# Altium schematic sheet rs485.SchDoc
size A4; Engineer: Amir Hossein Jobeiri; Organization: Simaran; SheetNumber: 23; SheetTotal: 24
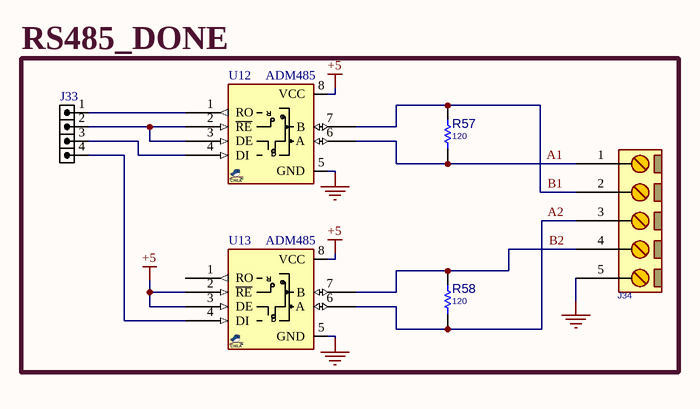
[diagram p0: rs485.SchDoc]

## Parts
J33  HDR1X4  [HDR_M_1X4]  (value not drawn)
J34  CONN_TB5  [TBG_5]  (value not drawn)
R57  120  [R025W_AX04]
R58  120  [R025W_AX04]
U12  ADM485  [DIP_8]
U13  ADM485  [DIP_8]

## Blocks framed on the sheet
RS485_DONE: J33 J34 R57 R58 U12 U13

## Nets
+5: U12.8(VCC) U13.2(~{RE}) U13.3(DE) U13.8(VCC)
GND: J34.5 U12.5(GND) U13.5(GND)
A1: J34.1 R57.1 U12.6(A)
A2: J34.3 R58.1 U13.6(A)
B1: J34.2 R57.2 U12.7(B)
B2: J34.4 R58.2 U13.7(B)
NetJ33_1: J33.1 U12.1(RO)
NetJ33_2: J33.2 U12.2(~{RE}) U12.3(DE)
NetJ33_3: J33.3 U12.4(DI)
NetJ33_4: J33.4 U13.4(DI)

Not connected (* = marked no-connect by the designer): U13 1(RO)

## Notes on the sheet
- (in symbol ADM485_DIP8) R; D

## Library data of the parts
J33 = HDR_M_1X4: CONN, HEADER, Male, pitch: 2.54mm, 4POS; VALUE: HDRM4
J34 = CONN_TB5: CONN, TERMINAL BLOCK, 5.08mm pitch; VALUE: CONN_TB5
R57 R58 = RES_THD: RESISTOR, THD; MANF_P#: RK73H1ETTP4701F; MANF: KOA SPEER; PARAM: 0.063W; DESC: DESCRIPTION; DIST#: MOUSER; PARAM2: 1%; ASSEMBLY: ASSEMBLY; PRICE: 100= 0.5$; VALUE: 120
U12 U13 = ADM485_DIP8: RS-485 Transceiver, 5V, DIP-8, ±7V Ground Difference Between Devices on the Bus; MANF_P#: ADM485AN; MANF: Analog Devices; PRICE: 4000toman@PAYA; VALUE: ADM485